# Altium project WAVEFORM_GENERATOR.PrjPcb
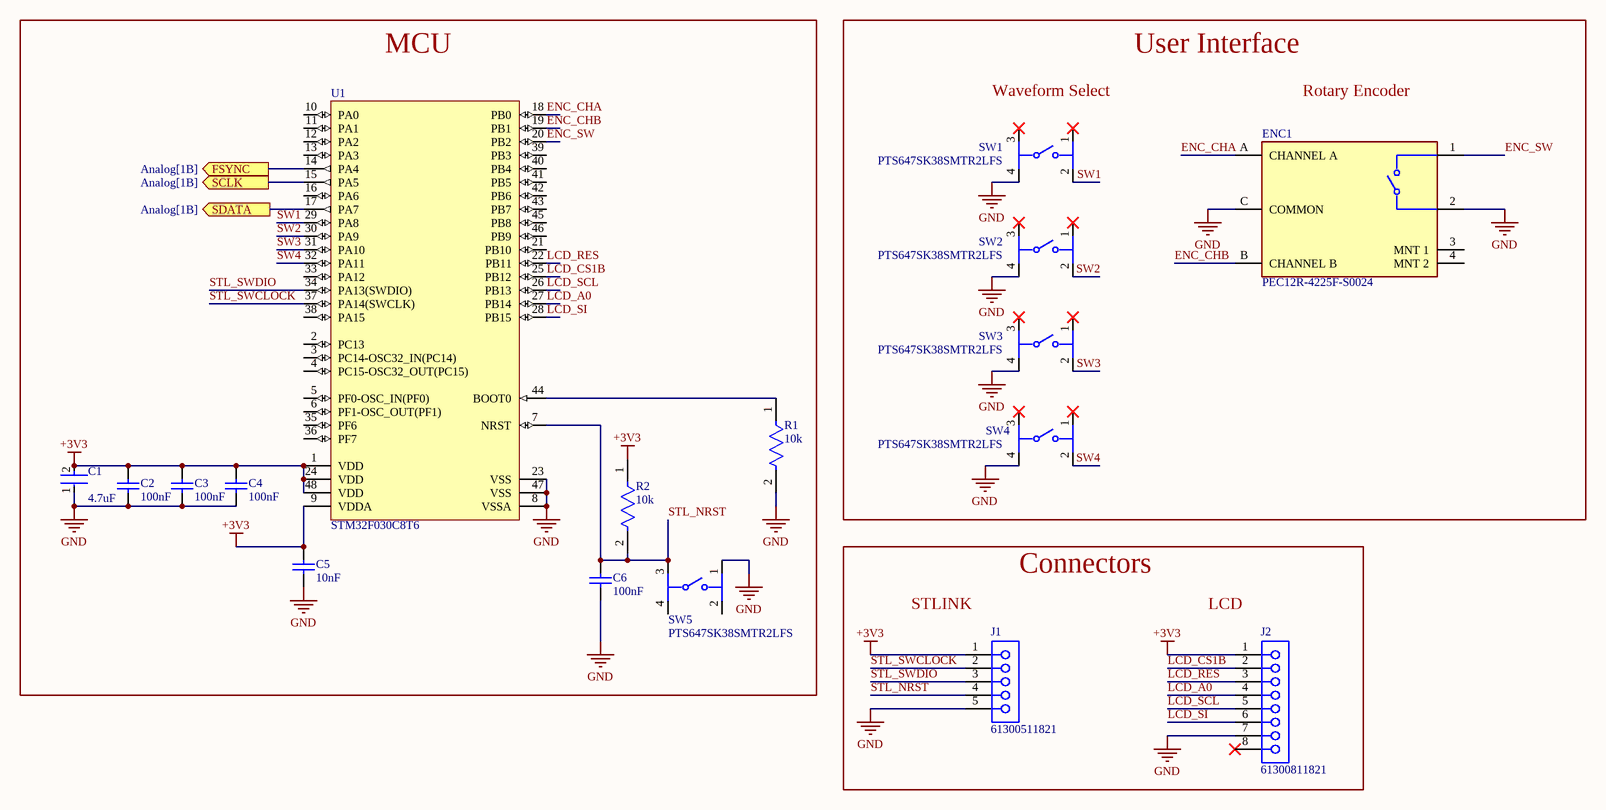
[diagram p0: Digital.SchDoc]
2 sheets, 53 parts. Net scope: flat (ports and power ports of the same name join across sheets).
Board file: WaveformGen.PcbDoc
Sheets:
  Digital.SchDoc
  Power.SchDoc

## Sheet Digital.SchDoc
size B; SheetNumber: 1; SheetTotal: 3

### Parts
C1  4.7uF  [FP-GRM219-0_15-0_1-IPC_B]
C2  100nF  [CAPC1608X87X45LL20T05]
C3  100nF  [CAPC1608X87X45LL20T05]
C4  100nF  [CAPC1608X87X45LL20T05]
C5  10nF  [CAPC1206(3216)150_L]
C6  100nF  [CAPC1608X87X45LL20T05]
ENC1  PEC12R-4225F-S0024  [FP-PEC12R-4225F-S0024-MFG]
J1  61300511821  [61300511821]
J2  61300811821  [61300811821]
R1  10k  [FP-TFCR0402-IPC_B]
R2  10k  [FP-TFCR0402-IPC_B]
SW1  PTS647SK38SMTR2LFS  [FP-PTS647SK38SMTR2LFS-MFG]
SW2  PTS647SK38SMTR2LFS  [FP-PTS647SK38SMTR2LFS-MFG]
SW3  PTS647SK38SMTR2LFS  [FP-PTS647SK38SMTR2LFS-MFG]
SW4  PTS647SK38SMTR2LFS  [FP-PTS647SK38SMTR2LFS-MFG]
SW5  PTS647SK38SMTR2LFS  [FP-PTS647SK38SMTR2LFS-MFG]
U1  STM32F030C8T6  [STM-LQFP48_M]

### Blocks framed on the sheet
MCU: C1-C6 R1 R2 SW5 U1
User Interface: ENC1 SW1-SW4
Connectors: J1 J2

### Ports
FSYNC (out, see Analog[1B]), SCLK (out, see Analog[1B]), SDATA (out, see Analog[1B])

### Nets
+3V3: C1.2 C2.2 C3.2 C4.2 C5.2 J1.1 J2.1 R2.1 U1.1(VDD) U1.9(VDDA) U1.24(VDD) U1.48(VDD)
GND: C1.1 C2.1 C3.1 C4.1 C5.1 C6.1 ENC1.2 ENC1.C(COMMON) J1.5 J2.7 R1.2 SW1.4 SW2.4 SW3.4 SW4.4 SW5.1 U1.8(VSSA) U1.23(VSS) U1.47(VSS)
ENC_CHA: ENC1.A(CHANNEL_A) U1.18(PB0)
ENC_CHB: ENC1.B(CHANNEL_B) U1.19(PB1)
ENC_SW: ENC1.1 U1.20(PB2)
LCD_A0: J2.4 U1.27(PB14)
LCD_CS1B: J2.2 U1.25(PB12)
LCD_RES: J2.3 U1.22(PB11)
LCD_SCL: J2.5 U1.26(PB13)
LCD_SI: J2.6 U1.28(PB15)
STL_NRST: C6.2 J1.4 R2.2 SW5.3 U1.7(NRST)
STL_SWCLOCK: J1.2 U1.37(PA14(SWCLK))
STL_SWDIO: J1.3 U1.34(PA13(SWDIO))
SW1: SW1.2 U1.29(PA8)
SW2: SW2.2 U1.30(PA9)
SW3: SW3.2 U1.31(PA10)
SW4: SW4.2 U1.32(PA11)
NetR1_1: R1.1 U1.44(BOOT0)
NetU1_14: U1.14(PA4) ; port FSYNC
NetU1_15: U1.15(PA5) ; port SCLK
NetU1_17: U1.17(PA7) ; port SDATA

Not connected (* = marked no-connect by the designer): ENC1 3(MNT_1) 4(MNT_2); J2 8*; SW1 1* 3*; SW2 1* 3*; SW3 1* 3*; SW4 1* 3*; SW5 2 4; U1 2(PC13) 3(PC14-OSC32_IN(PC14)) 4(PC15-OSC32_OUT(PC15)) 5(PF0-OSC_IN(PF0)) 6(PF1-OSC_OUT(PF1)) 10(PA0) 11(PA1) 12(PA2) 13(PA3) 16(PA6) 21(PB10) 33(PA12) 35(PF6) 36(PF7) 38(PA15) 39(PB3) 40(PB4) 41(PB5) 42(PB6) 43(PB7) 45(PB8) 46(PB9)

### Notes on the sheet
- Waveform Select
- Rotary Encoder
- (near J1) STLINK
- (near J2) LCD

### Library data of the parts
C1 = CMP-06035-028467-1: Chip Multilayer Ceramic Capacitors for General Purpose, 0805, 4.7uF, X5R, 15%, 20%, 25V
C2-C4 C6 = CMP-2006-00001-1: Ceramic 100nF X7R 16V 5%; Part Number: C0603X104J4RACTU; Manufacturer: Kemet
C5 = CMP-1037-03452-1: CAP 10nF 10V ±5% 1206 (3216 Metric) Thickness 1.45mm SMD; Tolerance: Â±5%; Case-Metric: 3216; Case-EIA: 1206; Max Thickness: 1.45 mm; Technology: SMT; Value: 10nF; Rated Voltage: 10 V
ENC1 = CMP-07421-000041-1: ROTARY ENCODER MECHANICAL 24PPR; Built in Switch: Yes; Hole Diameter: 1mm; Number of Channels: 2; Pulses per Revolution: 24; Output Type: Quadrature; Height: 13.4mm; Mount: Through Hole; RoHS Compliant: Yes; Orientation: Vertical; Length: 13.4mm; Encoder Type: Mechanical; Termination: PC Pin; Series: PEC12R; Min Operating Temperature: -30°C; Detent: Yes; REACH SVHC: No SVHC; Package Quantity: 75; Max Operating Temperature: 70°C; Packaging: Bulk; Width: 12.5mm
J1 = CMP-1502-01320-3: NexarPartId: 61924716; Current Rating: 3A; Operating Supply Voltage: 250V; Gender: Female; Contact Resistance: 20mΩ; Lead Pitch: 2.54mm; Orientation: Vertical; RoHS: Non-Compliant; Number of Pins: 5
J2 = CMP-1502-01327-3: NexarPartId: 61924723; Current Rating: 3A; Gender: Female; Contact Resistance: 20mΩ; Operating Supply Voltage: 250V; Lead Pitch: 2.54mm; RoHS: Non-Compliant; Orientation: Vertical; Number of Pins: 8
R1 R2 = CMP-250906-167145-1: RES Thin Film,  10kΩ, 0.1%, 0.063W, 50ppm/°C, 0402
SW1-SW5 = CMP-10040-000033-1: TACT 4.5 X 4.5, 3.8 MM H, 2.5N,; Switch Function: Off-Mom; Switch Travel: 0.25mm; Actuator Type: Standard; Illumination Type: Non-Illuminated; Mechanical Life: 100000Cycles; Ratings: IP40; Operating Force: 250gf; Throw Configuration: SPST; Max Operating Temperature: 70°C; Min Operating Temperature: -20°C; Termination: Gull Wing; Mount: Surface Mount; Packaging: Tape and Reel
U1 = CMP-0304-00064-2: ARM Cortex-M0 32-bit MCU, 64 KB Flash, 8 KB Internal RAM, 39 I/Os, 48-Pin LQFP, -40 to 85 degC, Tape and Reel; Manufacturer: STMicroelectronics; PartNumber: STM32F030C8T6TR; Supply Voltage(Vcc) min (V): 2.4; I/Os (High Current): 39; Operating Frequency(F) (Processor speed) (MHz): 48; FLASH Size (Prog) (kB): 64; Internal RAM Size (kB): 8; Mounting Technology: Surface Mount; ComponentLink1Description: Manufacturer URL; Core: ARM Cortex-M0; ComponentLink1URL: http://www.st.com/; Package Description: 48-Pin Low Profile Quad Flat Package, Body 7 x 7 mm, Pitch 0.5 mm; Packing: Tape and Reel; DatasheetVersion: Rev. 2; ComponentLink2URL: http://www.st.com/st-web-ui/static/active/en/resource/technical/document/datasheet/DM00088500.pdf; ComponentLink2Description: Datasheet; Package Reference: LQFP48

## Sheet Power.SchDoc
size B; SheetNumber: 2; SheetTotal: 3
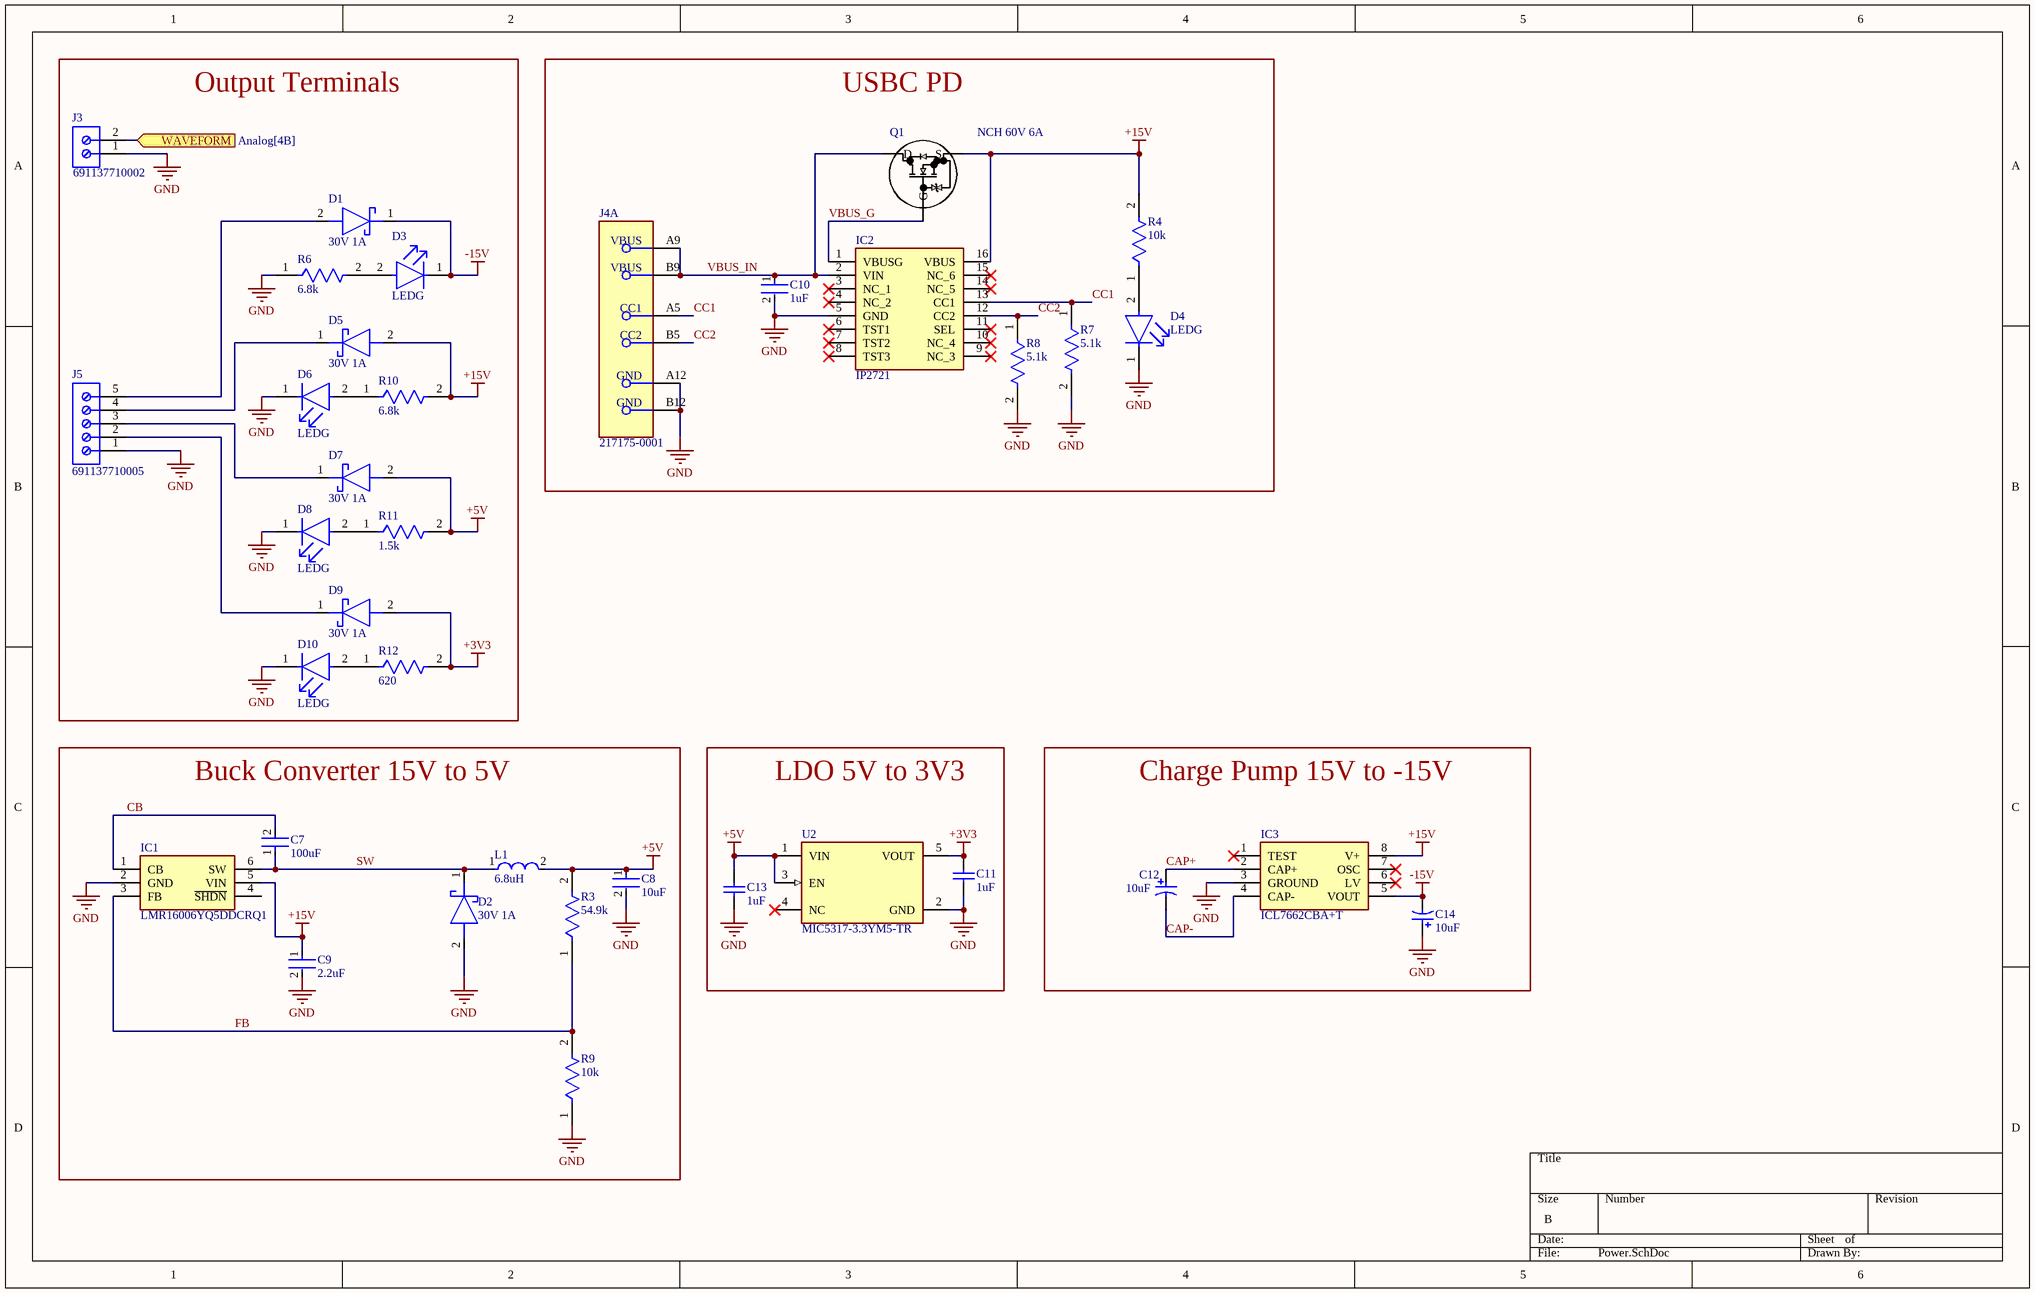
[diagram p1: Power.SchDoc]

### Parts
C7  100uF  [FP-C1206C-EB-MFG]
C8  10uF  [FP-CL21-IPC_A]
C9  2.2uF  [FP-C0402-BB-MFG]
C10  1uF  [FP-CGA5L-0_3-0_1-IPC_B]
C11  1uF  [CAPC1206(3216)130_N]
C12  10uF  [VISH-293D-E_L]
C13  1uF  [CAPC1206(3216)130_N]
C14  10uF  [VISH-293D-E_L]
D1  30V 1A  [1SS357TPH3F]
D2  30V 1A  [1SS357TPH3F]
D3  LEDG  [FP-LTST-C170GKT-MFG]
D4  LEDG  [FP-LTST-C170GKT-MFG]
D5  30V 1A  [1SS357TPH3F]
D6  LEDG  [FP-LTST-C170GKT-MFG]
D7  30V 1A  [1SS357TPH3F]
D8  LEDG  [FP-LTST-C170GKT-MFG]
D9  30V 1A  [1SS357TPH3F]
D10  LEDG  [FP-LTST-C170GKT-MFG]
IC1  LMR16006YQ5DDCRQ1  [SOT95P280X110-6N]
IC2  IP2721  [SOP65P640X120-16N]
IC3  ICL7662CBA+T  [SOIC127P600X175-8N]
J3  691137710002  [691137710002]
J4  217175-0001  [FP-217175-0001-MFG]  (part A of 2)
J5  691137710005  [691137710005]
L1  6.8uH  [FP-LQH3NPH_ME-MFG]
Q1  NCH 60V 6A  [SOT-323F_2-2U1S_UFM_TOS]
R3  54.9k  [FP-TFCR0603-IPC_C]
R4  10k  [FP-AT0805-IPC_C]
R6  6.8k  [FP-RMCF0805-MFG]
R7  5.1k  [FP-TFCR0603-IPC_A]
R8  5.1k  [FP-TFCR0603-IPC_A]
R9  10k  [FP-AT0805-IPC_C]
R10  6.8k  [FP-RMCF0805-MFG]
R11  1.5k  [FP-TFCR0402-IPC_B]
R12  620  [FP-TFCR0603-IPC_B]
U2  MIC5317-3.3YM5-TR  [FP-SOT23-5LD-PL-1-MFG]

### Blocks framed on the sheet
Output Terminals: D1 D3 D5-D10 J3 J5 R6 R10-R12
USBC PD: C10 D4 IC2 J4 Q1 R4 R7 R8
Buck Converter 15V to 5V: C7-C9 D2 IC1 L1 R3 R9
LDO 5V to 3V3: C11 C13 U2
Charge Pump 15V to -15V: C12 C14 IC3

### Ports
WAVEFORM (in, see Analog[4B])

### Nets
+3V3: C11.2 D9.2(A) R12.2 U2.5(VOUT)
+5V: C8.1 C13.2 D7.2(A) L1.2 R3.2 R11.2 U2.1(VIN) U2.3(EN)
+15V: C9.1 D5.2(A) IC1.5(VIN) IC2.16(VBUS) IC3.8(V+) Q1.2(S) R4.2 R10.2
-15V: C14.2 D1.1(K) D3.1(C) IC3.5(VOUT)
GND: C8.2 C9.2 C10.2 C11.1 C13.1 C14.1 D2.2(A) D4.1(C) D6.1(C) D8.1(C) D10.1(C) IC1.2(GND) IC2.5(GND) IC3.3(GROUND) J3.1 J4.A12(GND) J4.B12(GND) J5.1 R6.1 R7.2 R8.2 R9.1 U2.2(GND)
CAP+: C12.1 IC3.2(CAP+)
CAP-: C12.2 IC3.4(CAP-)
CB: C7.2 IC1.1(CB)
CC1: IC2.13(CC1) J4.A5(CC1) R7.1
CC2: IC2.12(CC2) J4.B5(CC2) R8.1
FB: IC1.3(FB) R3.1 R9.2
SW: C7.1 D2.1(K) IC1.6(SW) L1.1
VBUS_G: IC2.1(VBUSG) Q1.1(G)
VBUS_IN: C10.1 IC2.2(VIN) J4.A9(VBUS) J4.B9(VBUS) Q1.3(D)
NetD1_2: D1.2(A) J5.5
NetD3_2: D3.2(A) R6.2
NetD4_2: D4.2(A) R4.1
NetD5_1: D5.1(K) J5.4
NetD6_2: D6.2(A) R10.1
NetD7_1: D7.1(K) J5.3
NetD8_2: D8.2(A) R11.1
NetD9_1: D9.1(K) J5.2
NetD10_2: D10.2(A) R12.1
NetJ3_2: J3.2 ; port WAVEFORM

Not connected (* = marked no-connect by the designer): IC1 4(~{SHDN}); IC2 3(NC_1)* 4(NC_2)* 6(TST1)* 7(TST2)* 8(TST3)* 9(NC_3)* 10(NC_4)* 11(SEL)* 14(NC_5)* 15(NC_6)*; IC3 1(TEST)* 6(LV)* 7(OSC)*; U2 4(NC)*

### Library data of the parts
C7 = CMP-03020-014955-1: C1206 0.10 μF C0G 10.00% 25 V X7R; Manufacturer: KEMET; Manufacturer Part Number: C1206C104K3GACTU; Automotive Grade: Grade 0; Voltage Rating: 25 V; Tolerance: 0.1; Material: Ceramic; Capacitance: 0.10 μF; Temperature Coefficient: 15%; Value: 0.10 μF; Category: Cap; RoHS: TRUE; Temperature Range High: +150°C; Mouser Description: Multilayer Ceramic Capacitors MLCC - SMD/SMT 25volt 0.1uF 10% C0G; Lead Free: Yes; Temperature Characteristic: C0G; Octopart: https://octopart.com/c1206c104k3gactu-kemet-12901041; Device Class L3: Ceramic Capacitors; Ipc Land Pattern Name: CAPC320160X78; Temperature Range Low: -55°C; Device Class L1: Passive Components; Temperature: -55°C to +150°C; Automotive: Yes; ComponentLink2Description: Datasheet; Device Class L2: Capacitors; ComponentLink2URL: https://content.kemet.com/datasheets/KEM_C1007_X8R_ULTRA_150C_SMD.pdf; Package: C1206C-EB; Height: 0.88mm
C8 = CMP-13271-002975-1: CL21 Series 0805 10uF 25V ±10% Tolerance X5R Multilayer Ceramic Chip Capacitor; Case Code (Imperial): 0805; Length: 2mm; Case/Package: 0805; Packaging: Tape and Reel; Width: 0.049inch; Tolerance: 10%; Mount: Surface Mount; Min Operating Temperature: -55°C; Thickness: 0.057inch; Height: 1.25mm; Dielectric: X5R; Package Quantity: 1; Depth: 1.25mm; Capacitance: 10uF; Voltage Rating: 25V; Case Code (Metric): 2012; Max Operating Temperature: 85°C; Radiation Hardening: No
C9 = CMP-1034-01736-3: C0402 2,200 pF C0G 0.02 25 V; Manufacturer Part Number: C0402C222G3GACTU; Manufacturer: Kemet; Voltage Rating: 25 V; Tolerance: 0.02; Material: Ceramic; Lead Free: Yes; Device Class L1: Passive Components; Temperature Characteristic: C0G; RoHS: TRUE; Height: 0.55mm; Capacitance: 2,200 pF; ComponentLink2URL: https://content.kemet.com/datasheets/KEM_C1002_X7R_SMD.pdf; ComponentLink2Description: Datasheet; Automotive: No; Value: 2,200 pF; Temperature Range Low: -55°C; Category: Cap; Device Class L3: Ceramic Capacitors; Mouser Description: Multilayer Ceramic Capacitors MLCC - SMD/SMT 25volts 2200pF 2% C0G 0402; Octopart: https://octopart.com/c0402c222g3gactu-kemet-87368565; Device Class L2: Capacitors; Temperature: -55°C to +125°C; Package: C0402-BB; Ipc Land Pattern Name: CAPC10050X50; Temperature Range High: +125°C
C10 = CMP-08246-000049-1: Cap Ceramic 1uF 25V X7R 20% Pad SMD 1206 +125°C Automotive T/R; Voltage Rating (DC): 25V; Case Code (Imperial): 1206; Capacitance: 1uF; Packaging: Tape and Reel; Package Quantity: 2000; Tolerance: 20%; Weight: 0.000571oz; Case/Package: 1206; Case Code (Metric): 3216; Max Operating Temperature: 125°C; Voltage Rating: 25V; Mount: Surface Mount; Thickness: 0.063inch; Ratings: AEC-Q200; Min Operating Temperature: -55°C; Width: 1.6mm; Height: 1.6mm; Dielectric: X7R; Length: 0.126inch
C11 C13 = CMP-1037-04671-1: CAP 1uF 10V ±5% 1206 (3216 Metric) Thickness 1.3mm SMD; Case-EIA: 1206; Tolerance: Â±5%; Case-Metric: 3216; Value: 1uF; Technology: SMT; Rated Voltage: 10 V; Max Thickness: 1.3 mm
C12 C14 = CMP-2000-05556-1: Tantalum Capacitor, 10 uF, +/- 10%, 50 V, -55 to 125 degC, 2-Pin SMD (7343-43), RoHS, Tape and Reel; Manufacturer: Vishay; Capacitance: 10000000pF; Product Height (mm): 4mm; Lead Spacing (nom): NotRequiredmm; Product Depth (mm): 4.3mm; Seal: NotRequired; Case Style: Molded; DELETED: Compliant; Voltage: 50VDC; Product Length (mm): 7.3mm; Polarity: Polar; ESR: 0.8ohm; DF: 6%; Rad Hardened: No; DCL: 5uA; Package Description: 2-Pin Surface Mount Device, Body 7.3 x 4.3 mm; Datasheet URL: http://www.vishay.com/docs/40002/293d.pdf; Operating Temp Range: -55Cto125C; Seated Plane Height: NotRequiredmm; Mounting Technology: SurfaceMount; Insulation: NotRequired; Failure Rate: NotRequired; Construction: SMTChip; Packaging: TapeandReel; Mounting Style: SurfaceMount; Tolerance (+ or -): 10%; Product Diameter (mm): NotRequiredmm; Length W/Weld (max): NotRequiredmm; Length W/Weld: NotRequiredmm; Case Code: E; Datasheet Version: 08/2016; Package Reference: 293D-E; Package / Case: 7343-43; Manufacturer URL: http://www.vishay.com/; Wire Form: NotRequired
D1 D2 D5 D7 D9 = CUS10S30,H3F: Schottky Diode; Manufacturer_Name: Toshiba; Datasheet Link: http://toshiba.semicon-storage.com/info/docget.jsp?did=14077&prodName=CUS10S30; Height: 1mm; Manufacturer_Part_Number: CUS10S30,H3F; Mouser Part Number: 757-CUS10S30H3F; Mouser Price/Stock: https://www.mouser.co.uk/ProductDetail/Toshiba/CUS10S30H3F?qs=cW4DzVrAanO4Xm6ySrHr7g%3D%3D; Arrow Part Number: CUS10S30,H3F; Arrow Price/Stock: https://www.arrow.com/en/products/cus10s30h3f/toshiba?utm_currency=USD&region=nac
D3 D4 D6 D8 D10 = CMP-1674-00002-6: LED GREEN CLEAR SMD; Dominant Wavelength: 569nm; Lens Style: Diffused; Forward Voltage: 2.1V; Number of Elements: 1; Wavelength: 565nm; Luminous Intensity: 6mcd; Test Current: 10mA; Power Dissipation: 100mW; Reverse Voltage: 5V; Forward Current: 30mA; Viewing Angle: 130°; Lens Color: Colorless; Min Operating Temperature: -55°C; Number of Pins: 2; Max Operating Temperature: 85°C; Color: Green; Radiation Hardening: No; Illumination Color: Green; Case Code (Metric): 2012; Lens Transparency: Clear; Case/Package: 0805; Width: 1.25mm; Case Code (Imperial): 0805; Package Quantity: 1; Height: 1.1mm; Depth: 1.25mm; Length: 2mm; Power Rating: 100mW; Lead Free: Lead Free; Number of LEDs: 1; Packaging: Tape and Reel; Mount: Surface Mount; Voltage: 5V
IC1 = LMR16006YQ5DDCRQ1: Integrated Circuit; Manufacturer_Name: Texas Instruments; Datasheet Link: http://www.ti.com/lit/gpn/lmr16006y-q1; Height: 1.1mm; Manufacturer_Part_Number: LMR16006YQ5DDCRQ1; Mouser Part Number: 595-MR16006YQ5DDCRQ1; Mouser Price/Stock: https://www.mouser.co.uk/ProductDetail/Texas-Instruments/LMR16006YQ5DDCRQ1?qs=XJu%252BLGjWfSDhOUpGCmjN4w%3D%3D; Arrow Part Number: LMR16006YQ5DDCRQ1; Arrow Price/Stock: https://www.arrow.com/en/products/lmr16006yq5ddcrq1/texas-instruments?utm_currency=USD&region=nac
IC2 = IP2721: Integrated Circuit; Manufacturer_Name: INJOINIC; Datasheet Link: https://datasheet.lcsc.com/szlcsc/2006111335_INJOINIC-IP2721_C603176.pdf; Height: 1.2mm; Manufacturer_Part_Number: IP2721
IC3 = ICL7662CBA+T: Integrated Circuit; Manufacturer_Name: Analog Devices; Datasheet Link: https://datasheet.datasheetarchive.com/originals/dk/DKDS-7/135327.pdf; Height: 1.75mm; Manufacturer_Part_Number: ICL7662CBA+T; Mouser Part Number: 700-ICL7662CBAT; Mouser Price/Stock: https://www.mouser.co.uk/ProductDetail/Analog-Devices-Maxim-Integrated/ICL7662CBA%2bT?qs=Mqkh4jHMT8yEwIZBI%252Brh9g%3D%3D; Arrow Part Number: ICL7662CBA+T; Arrow Price/Stock: https://www.arrow.com/en/products/icl7662cbat/analog-devices?region=nac
J3 = CMP-1502-03324-2: NexarPartId: 78871135; Voltage Rating: 300V; Number of Contacts: 2; Current Rating: 16A; Lead Pitch: 5mm; Height: 11.6mm; Packaging: Box; RoHS: Non-Compliant; Contact Material: Nickel, Tin; Max Operating Temperature: 120°C; Number of Pins: 2; Min Operating Temperature: -30°C; Number of Rows: 1
J4 = CMP-04767-000026-1: CONN RCP USB2.0 C 6+18P SMD RA
J5 = CMP-1502-03327-2: NexarPartId: 78871141; Lead Pitch: 5mm; RoHS: Non-Compliant; Number of Pins: 5; Packaging: Box
L1 = CMP-06042-015081-1: Wire Wound Ferrite Inductor for Power Lines For Automotive 6.8μH ±20% 0.168Ω 1450mA 1212
Q1 = SSM3K341TU,LF: N-ch MOSFET, 60 V, 6.0 A, 0.036 Î©@10V, SOT-323F(UFM); Manufacturer_Name: Toshiba Electronic Devices & Storage Corp.; Copyright: Copyright (C) 2025 Ultra Librarian. All rights reserved.; Manufacturer_Part_Number: SSM3K341TU,LF; Datasheet: https://toshiba.semicon-storage.com/info/docget.jsp?did=56016&prodName=SSM3K341TU
R3 = CMP-250906-169285-1: RES Thin Film,  54.9kΩ, 0.25%, 0.1W, 50ppm/°C, 0603
R4 R9 = CMP-03412-048709-1: Thin Film Chip Resistors Automotive Grade 10kΩ 0.1% 50ppm/°C 0805
R6 R10 = CMP-26527-002688-1: 6.8kΩ ±5% 0.125W 0805 Thick Film Chip Resistor AEC-Q200 compliant; Power Rating: 125mW; Resistance: 6.8kR; Temperature Coefficient: 200ppm/°C; Contact Plating: Tin; Tolerance: 5%; Mount: Surface Mount; Lead Free: Lead Free; Max Operating Temperature: 155°C; Case Code (Metric): 2012; Construction: Rectangular; RoHS Compliant: Yes; Height: 0.026inch; Depth: 1.25mm; Length: 0.079inch; Features: Automotive AEC-Q200; Military Standard: Not; Number of Terminations: 2; Case Code (Imperial): 0805; Resistor Type: Thick Film; Series: RMCF; Max Power Dissipation: 125mW; Size Code: 0805; Radiation Hardening: No; Min Operating Temperature: -55°C; Case/Package: 0805; Packaging: Tape and Reel; Width: 0.049inch
R7 R8 = CMP-250906-167103-1: RES Thin Film,  5.1kΩ, 0.25%, 0.1W, 25ppm/°C, 0603
R11 = CMP-250906-175014-1: RES Thin Film,  1.5kΩ, 1%, 0.063W, 100ppm/°C, 0402
R12 = CMP-250906-226900-1: RES Thin Film,  620Ω, 0.25%, 0.1W, 25ppm/°C, 0603
U2 = CMP-06324-000116-1: IC REG LINEAR 3.3V 150MA SOT23-5; Max Input Voltage: 6V; Number of Regulators: 1; Min Current Limit: 200mA; Dropout Voltage: 155mV; Min Input Voltage: 2.5V; Power Supply Rejection Ratio (PSRR): 70dB; Case/Package: SOT-23-5; Output Voltage: 3.3V; Series: -; Max Operating Temperature: 125°C; Package Quantity: 3000; Mount: Surface Mount; Packaging: Tape and Reel; RoHS Compliant: No; Output Current: 150mA; Min Operating Temperature: -40°C; Number of Outputs: 1

## Nets that join several sheets
+3V3: Digital (12 pins), Power (C11.2 D9.2 R12.2 U2.5)
GND: Digital (19 pins), Power (23 pins)